# Altium project QUTMS_Shutdownboard_V2_1.PrjPcb
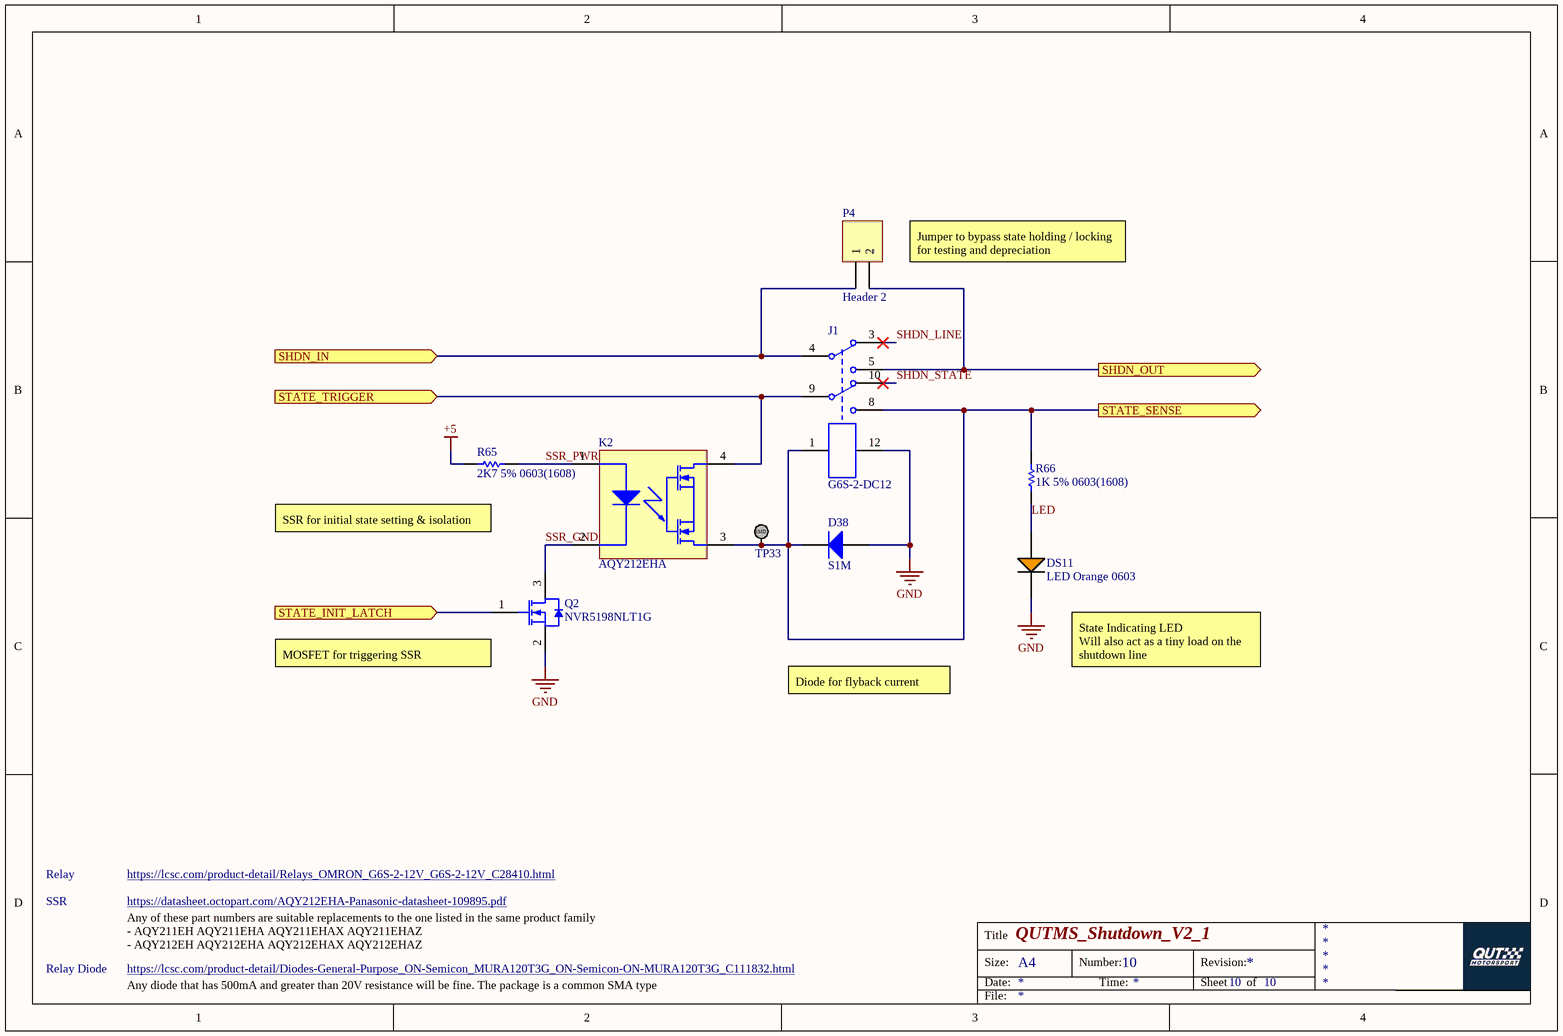
[diagram p0: ShutdownSegement.SchDoc]
4 sheets, 93 parts. Net scope: hierarchical (ports join the sheet entries above them; power ports are global).
Board file: DeutschPCB.PcbDoc
Sheets:
  ShutdownSegement.SchDoc
  Master.SchDoc
    BSPD_Simulation = BSPD_Simulation.SchDoc
    SHDN_INPUT_PROTECTION1 = 12VInputProtection.SchDoc
    SHDN_INPUT_PROTECTION2 = 12VInputProtection.SchDoc
    SHDN_INPUT_PROTECTION3 = 12VInputProtection.SchDoc
    SHDN_INPUT_PROTECTION4 = 12VInputProtection.SchDoc
    SHDN_INPUT_PROTECTION5 = 12VInputProtection.SchDoc
    SHDN_INPUT_PROTECTION6 = 12VInputProtection.SchDoc
    SHDN_INPUT_PROTECTION7 = 12VInputProtection.SchDoc
    SHDN_INPUT_PROTECTION8 = 12VInputProtection.SchDoc
    SHDN_INPUT_PROTECTION9 = 12VInputProtection.SchDoc
    SHDN_INPUT_PROTECTION10 = 12VInputProtection.SchDoc
    SHDN_INPUT_PROTECTION11 = 12VInputProtection.SchDoc
    SHDN_INPUT_PROTECTION12 = 12VInputProtection.SchDoc
    SHDN_INPUT_PROTECTION13 = 12VInputProtection.SchDoc
    SHDN_INPUT_PROTECTION14 = 12VInputProtection.SchDoc
    SHDN_INPUT_PROTECTION15 = 12VInputProtection.SchDoc
    SHDN_INPUT_PROTECTION16 = 12VInputProtection.SchDoc
    SHDN_INPUT_PROTECTION17 = 12VInputProtection.SchDoc
    SHDN_INPUT_PROTECTION18 = 12VInputProtection.SchDoc

## Sheet ShutdownSegement.SchDoc: QUTMS_Shutdown_V2_1
size A4; DocumentNumber: 10; SheetNumber: 10; SheetTotal: 10

### Parts
D38  S1M  [FAIR-DO-214AC-2_V]
DS11  LED Orange 0603  [LED ORANGE 0603]
J1  G6S-2-DC12  [G6S-2]
K2  AQY212EHA  [PNSC-DIP4(SMT)_V]
P4  Header 2  [HDR1X2]
Q2  NVR5198NLT1G  [ONSC-SOT-23-3-318-08_V]
R65  2K7 5% 0603(1608)  [RESC0603(1608)_M]
R66  1K 5% 0603(1608)  [RESC0603(1608)_L]
TP33  TestPoint_SMD  [TestPointSMD]  (value not drawn)

### Ports
SHDN_IN (in), SHDN_OUT (out), STATE_INIT_LATCH (in), STATE_SENSE (out), STATE_TRIGGER (in)

### Nets
+5: R65.1
GND: D38.1(A) DS11.2(C) J1.12 Q2.2(S)
LED: DS11.1(A) R66.1
SHDN_LINE: J1.3
SHDN_STATE: J1.10
SSR_GND: K2.2 Q2.3(D)
SSR_PWR: K2.1 R65.2
NetD38_2: D38.2(K) J1.1 J1.8 K2.3 R66.2 TP33.1 ; port STATE_SENSE
NetJ1_4: J1.4 P4.1 ; port SHDN_IN
NetJ1_5: J1.5 P4.2 ; port SHDN_OUT
NetJ1_9: J1.9 K2.4 ; port STATE_TRIGGER
NetQ2_1: Q2.1(G) ; port STATE_INIT_LATCH

### Notes on the sheet
- (near P4) Jumper to bypass state holding / locking for testing and depreciation
- (near R65) SSR for initial state setting & isolation
- (near Q2) MOSFET for triggering SSR
- Diode for flyback current
- State Indicating LED
  Will also act as a tiny load on the shutdown line
- SSR
- Relay
- https://datasheet.octopart.com/AQY212EHA-Panasonic-datasheet-109895.pdf
- https://lcsc.com/product-detail/Relays_OMRON_G6S-2-12V_G6S-2-12V_C28410.html
- Relay Diode
- Any of these part numbers are suitable replacements to the one listed in the same product family
  - AQY211EH AQY211EHA AQY211EHAX AQY211EHAZ
  - AQY212EH AQY212EHA AQY212EHAX AQY212EHAZ
- https://lcsc.com/product-detail/Diodes-General-Purpose_ON-Semicon_MURA120T3G_ON-Semicon-ON-MURA120T3G_C111832.html
- Any diode that has 500mA and greater than 20V resistance will be fine. The package is a common SMA type
- Title
- Size:
- Date:
- A4
- Number:
- Time:
- Revision:
- Sheet
- of
- File:
- (in symbol TestPoint_SMD) SMD

### Library data of the parts
D38 = CMP-2000-04942-2: General Purpose Rectifier, 1 A, 1000 V, -55 to 150 degC, 2-Pin DO-214AC, RoHS, Tape and Reel; Manufacturer: Fairchild; Repetitive Reverse Voltage Vrrm Max: 1kV; Reel Quantity: 7500; Forward Voltage: 1V; No. of Pins: 2; External Depth: 2.79mm; Current Ifsm: 30A; Diode Configuration: Single; Reverse Recovery Time trr Max: 1.8µs; Diode Type: StandardRecovery; External Width: 5.28mm; SVHC: NoSVHC(19-Dec-2012); External Length / Height: 2.44mm; Diode Polarity: Cathode; Current If @ Vf: 1A; SMD Marking: 1M; Tape Width: 12mm; Datasheet URL: https://datasheet.ciiva.com/4452/s1m-191340-4452980.pdf; Alternate Case Style: DO-214AC; Package Reference: DO-214AC-2; Diode Case Style: DO-214AC; Package / Case: SMA; Junction Temperature Tj Max: 150degC; Operating Temperature Range: -55degCto+150degC; Operating Temperature Min: -55degC; Datasheet Version: Rev. 1.1.2, 10/2013; Manufacturer URL: https://www.fairchildsemi.com/; Termination Type: SMD; Forward Surge Current Ifsm Max: 30A; Operating Temperature Max: 150degC; Package Description: 2-Pin Surface Mount Device, Body 4.375 x 2.725 mm; Package URL: https://www.fairchildsemi.com/package-drawings/DO/DO214AC.pdf; Reverse Recovery Time trr Typ: 1.8µs; Forward Voltage VF Max: 1V; Forward Current If(AV): 1A
J1 = G6S-2-DC12: Telecom Non Latching 12VDC DPDT 2A Through Hole Relays RoHS; ComponentLink1Description: LCSC; ComponentLink1URL: https://lcsc.com/product-detail/Relays_OMRON_G6S-2-12V_G6S-2-12V_C28410.html
K2 = CMP-1346-00006-1: PhotoMOS GE 1 Form A, 60 V Load Voltage, 0.55 A Continuous Load Current, -40 to 85 degC, 4-Pin DIP(SMT), Tube, RoHS; Manufacturer: Panasonic; Continuous Load Current: 0.55 A; Load Voltage: 60 V; On Resistance (Typ): 0.85 Ohm; Pb-Free: True; ComponentLink2Description: Datasheet; PackageVersion: ASCTB67E, 04/2014; DatasheetVersion: 201404-T; Packing: Tube; ComponentLink1URL: http://www3.panasonic.biz/ac/ae/index.jsp; PackageReference: DIP4(SMT); Series: PhotoMOS GE 1 Form A; RoHS: True; ComponentLink1Description: Manufacturer URL; ComponentLink3Description: Package Specification; PartNumber: AQY212EHA; PackageDescription: 4-Pin Surface Mount Terminal Package, Body 4.78 x 6.4 mm, Pitch 2.54mm; ComponentLink2URL: http://www3.panasonic.biz/ac/e_download/control/relay/photomos/catalog/semi_eng_ge1a_aqy21_e.pdf; ComponentLink3URL: http://www3.panasonic.biz/ac/e_download/control/relay/photomos/catalog/semi_eng_dimensions.pdf?f_cd=401560; Mounting Technology: Surface Mount
P4 = Header 2: Header, 2-Pin; LatestRevisionDate: 17-Jul-2002; LatestRevisionNote: Re-released for DXP Platform.; Publisher: Altium Limited
Q2 = CMP-1058-00774-1: Power MOSFET, 60 V, 155 mOhm, Single N-Channel Logic Level, 3-Pin SOT-23, Pb-Free, Tape and Reel; Manufacturer: On Semiconductor; Ciss Typ (pF): 182; Coss Typ (pF): 25; ID Max (A): 2.2; Crss Typ (pF): 16; V(BR)DSS Min (V): 60; Qrr Typ (nC): 6; VGS Max (V): 20; VGS(th) Max (V): 2.5; Channel Polarity: N Channel; Package Type: SOT-23-3; ComponentLink1URL: http://www.onsemi.com/; ComponentLink2Description: Datasheet; ComponentLink1Description: Manufacturer URL; Mounting Technology: Surface Mount; Configuration: Single; Packing: Tape and Reel; RoHS: Pb-Free; ComponentLink3URL: http://www.onsemi.cn/pub_link/Collateral/318-08.PDF; PackageVersion: Rev. AP, 11/2009; PackageReference: SOT-23-3-318-08; DatasheetVersion: Rev. 1; PackageDescription: 3-Pin Small Outline Transistor, Body 2.92 x 1.3 mm, Pitch 0.95 mm; ComponentLink3Description: Package Specification; ComponentLink2URL: http://www.onsemi.com/pub_link/Collateral/NVR5198NL-D.PDF; PartNumber: NVR5198NLT1G
R65 = CMP-1012-00084-1: 2K7 0.1W 5% 0603 (1608 Metric)  SMD; Case-EIA: 0603; Value: 2700.00 Ohm; Case-Metric: 1608; Tolerance: 5 %; Power: 0.1 W; Technology: SMT
R66 = CMP-1012-00074-1: 1K 0.1W 5% 0603 (1608 Metric)  SMD; Case-EIA: 0603; Case-Metric: 1608; Value: 1000.00 Ohm; Technology: SMT; Tolerance: 5 %; Power: 0.1 W

## Sheet Master.SchDoc
size A3
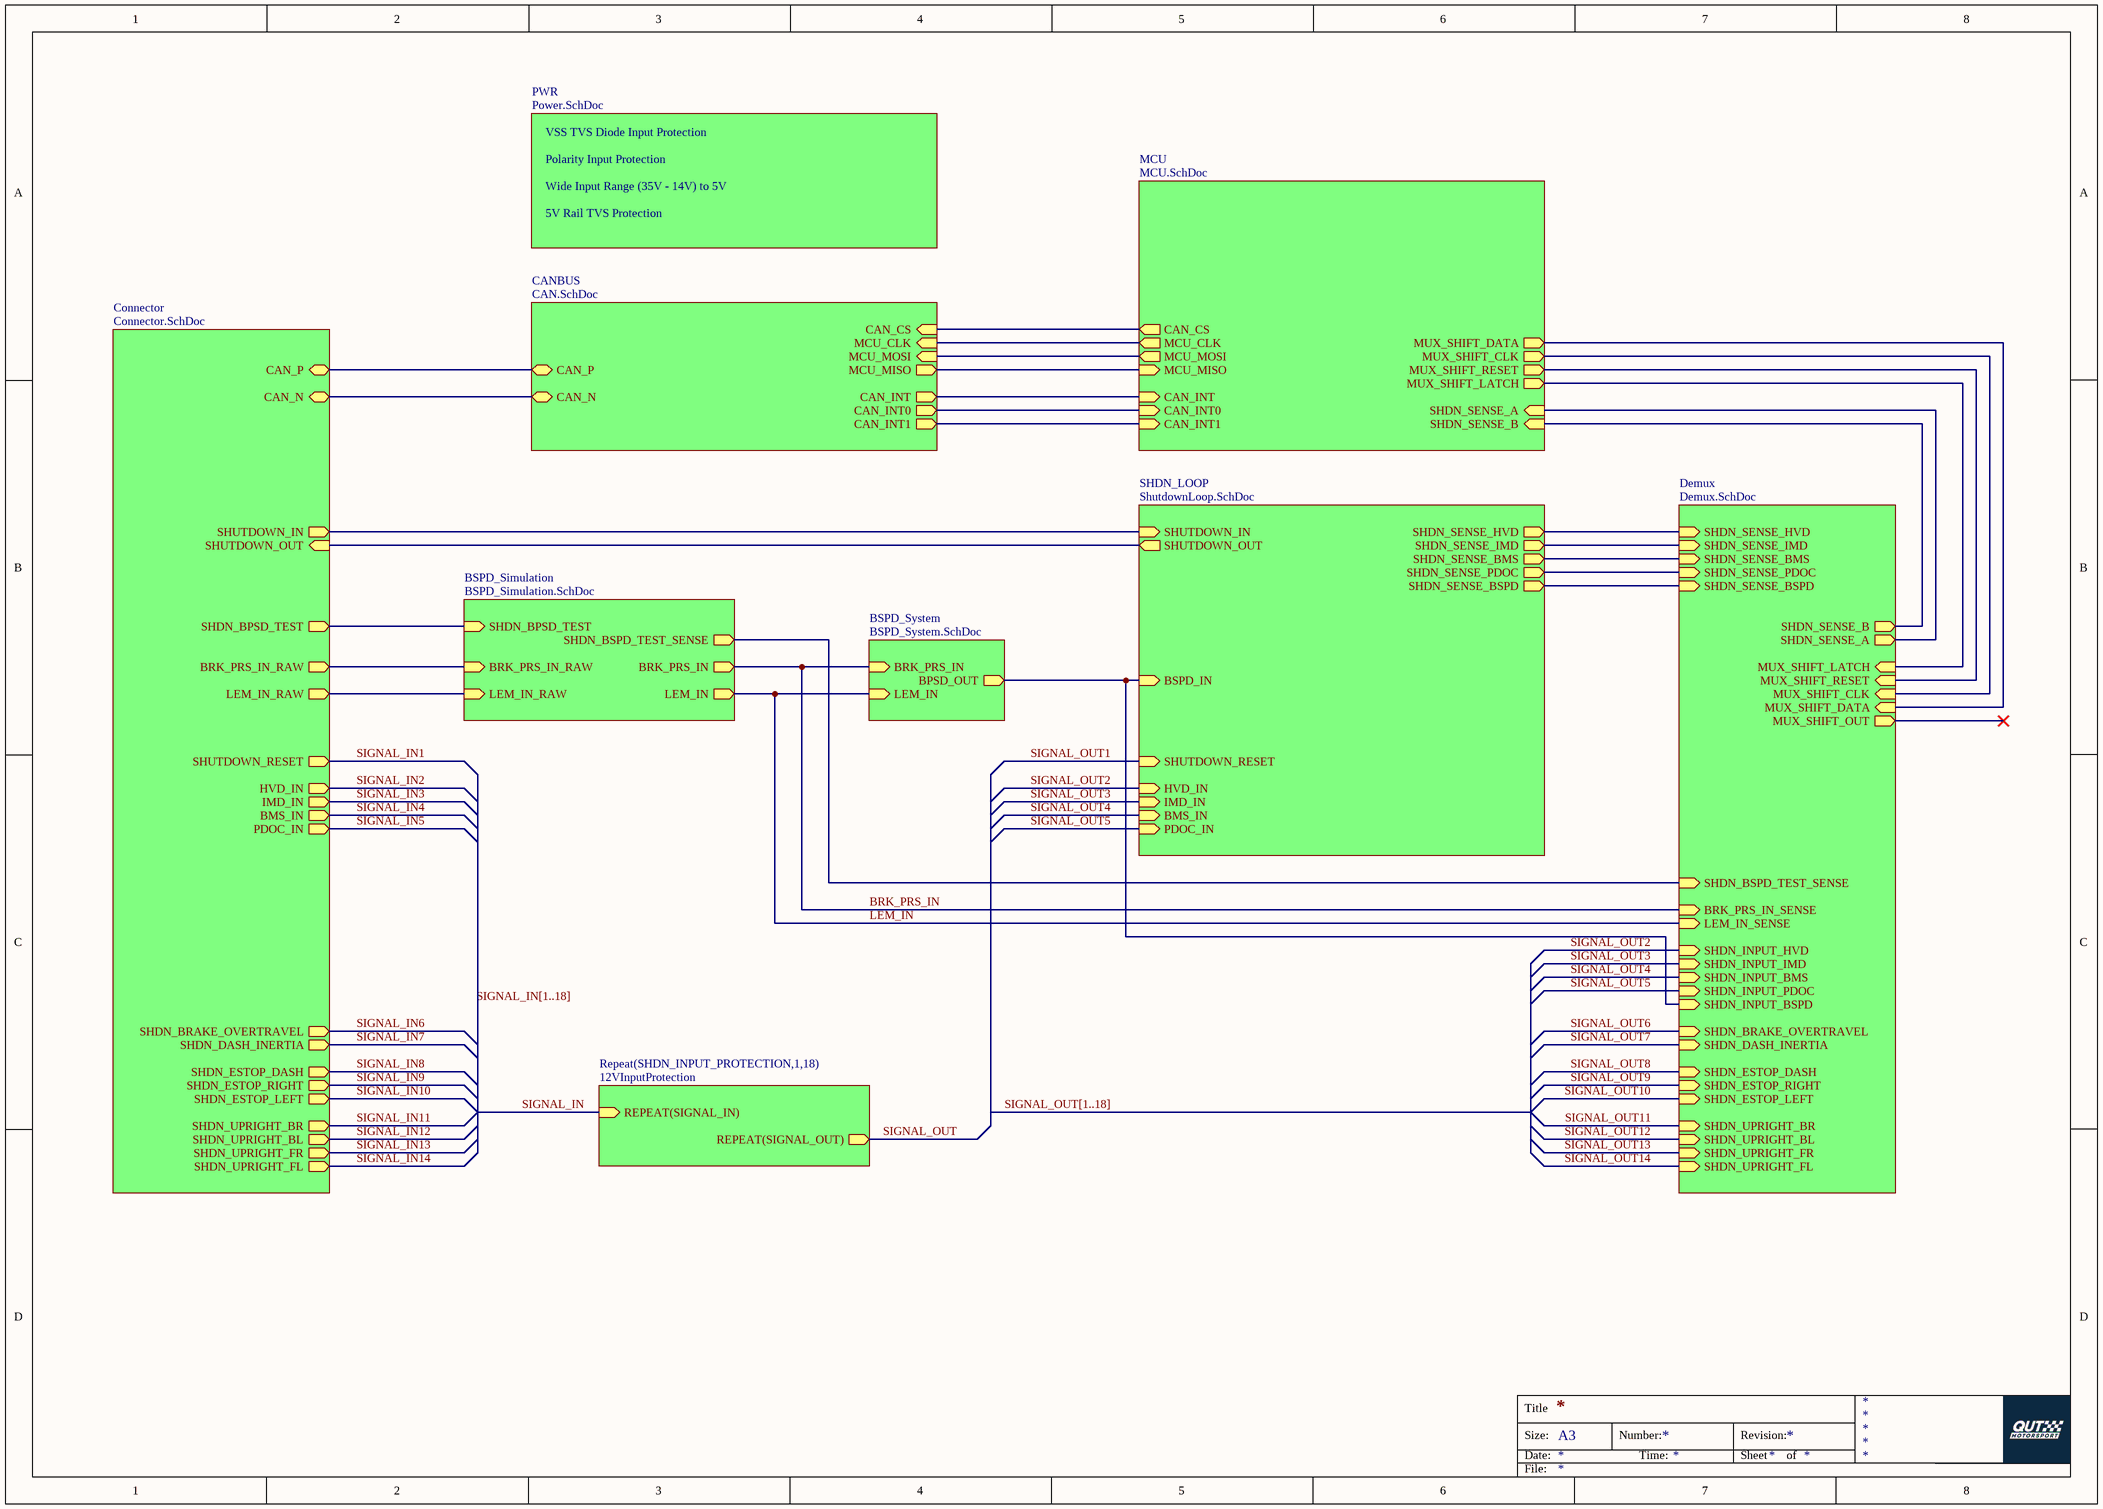
[diagram p1: Master.SchDoc]

### Sub-sheets
BSPD_Simulation = BSPD_Simulation.SchDoc: LEM_IN_RAW (in), SHDN_BSPD_TEST_SENSE (out), BRK_PRS_IN (out), LEM_IN (out), SHDN_BPSD_TEST (in), BRK_PRS_IN_RAW (in)
BSPD_System = BSPD_System.SchDoc (file not in this document): BRK_PRS_IN (in), BPSD_OUT (out), LEM_IN (in)
CANBUS = CAN.SchDoc (file not in this document): MCU_MOSI (in), MCU_CLK (in), CAN_CS (in), MCU_MISO (out), CAN_N (bidir), CAN_P (bidir), CAN_INT1 (out), CAN_INT0 (out), CAN_INT (out)
Connector = Connector.SchDoc (file not in this document): SHDN_BRAKE_OVERTRAVEL (out), SHDN_BPSD_TEST (out), CAN_N (bidir), CAN_P (bidir), SHUTDOWN_IN (out), HVD_IN (out), SHUTDOWN_OUT (in), BRK_PRS_IN_RAW (out), LEM_IN_RAW (out), IMD_IN (out), BMS_IN (out), SHDN_ESTOP_DASH (out), SHDN_DASH_INERTIA (out), PDOC_IN (out), SHUTDOWN_RESET (out), SHDN_ESTOP_RIGHT (out), SHDN_ESTOP_LEFT (out), SHDN_UPRIGHT_BR (out), SHDN_UPRIGHT_BL (out), SHDN_UPRIGHT_FR (out), SHDN_UPRIGHT_FL (out)
Demux = Demux.SchDoc (file not in this document): SHDN_ESTOP_DASH (in), SHDN_UPRIGHT_BL (in), SHDN_UPRIGHT_BR (in), SHDN_ESTOP_LEFT (in), SHDN_ESTOP_RIGHT (in), SHDN_DASH_INERTIA (in), SHDN_UPRIGHT_FR (in), SHDN_UPRIGHT_FL (in), SHDN_BRAKE_OVERTRAVEL (in), SHDN_BSPD_TEST_SENSE (in), BRK_PRS_IN_SENSE (in), LEM_IN_SENSE (in), SHDN_INPUT_HVD (in), SHDN_INPUT_IMD (in), SHDN_INPUT_BMS (in), SHDN_INPUT_PDOC (in), SHDN_INPUT_BSPD (in), SHDN_SENSE_HVD (in), SHDN_SENSE_IMD (in), SHDN_SENSE_BMS (in), SHDN_SENSE_PDOC (in), SHDN_SENSE_BSPD (in), SHDN_SENSE_A (out), MUX_SHIFT_OUT (out), SHDN_SENSE_B (out), MUX_SHIFT_LATCH (in), MUX_SHIFT_RESET (in), MUX_SHIFT_CLK (in), MUX_SHIFT_DATA (in)
MCU = MCU.SchDoc (file not in this document): MCU_MISO (in), MCU_MOSI (out), CAN_CS (out), MCU_CLK (out), CAN_INT (in), CAN_INT0 (in), CAN_INT1 (in), SHDN_SENSE_B (in), SHDN_SENSE_A (in), MUX_SHIFT_LATCH (out), MUX_SHIFT_RESET (out), MUX_SHIFT_CLK (out), MUX_SHIFT_DATA (out)
PWR = Power.SchDoc (file not in this document): no entries
Repeat(SHDN_INPUT_PROTECTION,1,18) = 12VInputProtection: REPEAT(SIGNAL_OUT) (out), REPEAT(SIGNAL_IN) (in)
SHDN_LOOP = ShutdownLoop.SchDoc (file not in this document): SHDN_SENSE_BSPD (out), SHDN_SENSE_PDOC (out), SHDN_SENSE_BMS (out), SHDN_SENSE_IMD (out), HVD_IN (in), SHUTDOWN_RESET (in), IMD_IN (in), BMS_IN (in), PDOC_IN (in), SHUTDOWN_OUT (out), SHUTDOWN_IN (in), BSPD_IN (in), SHDN_SENSE_HVD (out)

### Nets
BRK_PRS_IN: sheet Demux/BRK_PRS_IN_SENSE, sheet BSPD_System/BRK_PRS_IN, sheet BSPD_Simulation/BRK_PRS_IN
LEM_IN: sheet Demux/LEM_IN_SENSE, sheet BSPD_System/LEM_IN, sheet BSPD_Simulation/LEM_IN
SHDN_BSPD_TEST_COMMAND: sheet Demux/SHDN_BSPD_TEST_SENSE, sheet BSPD_Simulation/SHDN_BSPD_TEST_SENSE
SIGNAL_IN: sheet Repeat(SHDN_INPUT_PROTECTION,1,18)/REPEAT(SIGNAL_IN)
SIGNAL_IN1: sheet Connector/SHUTDOWN_RESET, sheet SHDN_LOOP/SHUTDOWN_RESET  [also labelled SIGNAL_OUT1]
SIGNAL_IN2: sheet Connector/HVD_IN, sheet SHDN_LOOP/HVD_IN, sheet Demux/SHDN_INPUT_HVD  [also labelled SIGNAL_OUT2]
SIGNAL_IN3: sheet Connector/IMD_IN, sheet SHDN_LOOP/IMD_IN, sheet Demux/SHDN_INPUT_IMD  [also labelled SIGNAL_OUT3]
SIGNAL_IN4: sheet Connector/BMS_IN, sheet SHDN_LOOP/BMS_IN, sheet Demux/SHDN_INPUT_BMS  [also labelled SIGNAL_OUT4]
SIGNAL_IN5: sheet Connector/PDOC_IN, sheet SHDN_LOOP/PDOC_IN, sheet Demux/SHDN_INPUT_PDOC  [also labelled SIGNAL_OUT5]
SIGNAL_IN6: sheet Connector/SHDN_BRAKE_OVERTRAVEL, sheet Demux/SHDN_BRAKE_OVERTRAVEL  [also labelled SIGNAL_OUT6]
SIGNAL_IN7: sheet Connector/SHDN_DASH_INERTIA, sheet Demux/SHDN_DASH_INERTIA  [also labelled SIGNAL_OUT7]
SIGNAL_IN8: sheet Connector/SHDN_ESTOP_DASH, sheet Demux/SHDN_ESTOP_DASH  [also labelled SIGNAL_OUT8]
SIGNAL_IN9: sheet Connector/SHDN_ESTOP_RIGHT, sheet Demux/SHDN_ESTOP_RIGHT  [also labelled SIGNAL_OUT9]
SIGNAL_IN10: sheet Connector/SHDN_ESTOP_LEFT, sheet Demux/SHDN_ESTOP_LEFT  [also labelled SIGNAL_OUT10]
SIGNAL_IN11: sheet Connector/SHDN_UPRIGHT_BR, sheet Demux/SHDN_UPRIGHT_BR  [also labelled SIGNAL_OUT11]
SIGNAL_IN12: sheet Connector/SHDN_UPRIGHT_BL, sheet Demux/SHDN_UPRIGHT_BL  [also labelled SIGNAL_OUT12]
SIGNAL_IN13: sheet Connector/SHDN_UPRIGHT_FR, sheet Demux/SHDN_UPRIGHT_FR  [also labelled SIGNAL_OUT13]
SIGNAL_IN14: sheet Connector/SHDN_UPRIGHT_FL, sheet Demux/SHDN_UPRIGHT_FL  [also labelled SIGNAL_OUT14]
SIGNAL_OUT: sheet Repeat(SHDN_INPUT_PROTECTION,1,18)/REPEAT(SIGNAL_OUT)
NetC1_1: sheet Connector/BRK_PRS_IN_RAW, sheet BSPD_Simulation/BRK_PRS_IN_RAW
NetC4_1: sheet Connector/LEM_IN_RAW, sheet BSPD_Simulation/LEM_IN_RAW
NetR4_2: sheet Connector/SHDN_BPSD_TEST, sheet BSPD_Simulation/SHDN_BPSD_TEST
(unnamed): sheet Connector/CAN_N, sheet CANBUS/CAN_N
(unnamed): sheet Connector/CAN_P, sheet CANBUS/CAN_P
(unnamed): sheet Connector/SHUTDOWN_IN, sheet SHDN_LOOP/SHUTDOWN_IN
(unnamed): sheet Connector/SHUTDOWN_OUT, sheet SHDN_LOOP/SHUTDOWN_OUT
(unnamed): sheet SHDN_LOOP/SHDN_SENSE_BSPD, sheet Demux/SHDN_SENSE_BSPD
(unnamed): sheet SHDN_LOOP/SHDN_SENSE_PDOC, sheet Demux/SHDN_SENSE_PDOC
(unnamed): sheet SHDN_LOOP/SHDN_SENSE_BMS, sheet Demux/SHDN_SENSE_BMS
(unnamed): sheet SHDN_LOOP/SHDN_SENSE_IMD, sheet Demux/SHDN_SENSE_IMD
(unnamed): sheet SHDN_LOOP/BSPD_IN, sheet Demux/SHDN_INPUT_BSPD, sheet BSPD_System/BPSD_OUT
(unnamed): sheet SHDN_LOOP/SHDN_SENSE_HVD, sheet Demux/SHDN_SENSE_HVD
(unnamed): sheet MCU/MCU_MISO, sheet CANBUS/MCU_MISO
(unnamed): sheet MCU/MCU_MOSI, sheet CANBUS/MCU_MOSI
(unnamed): sheet MCU/CAN_CS, sheet CANBUS/CAN_CS
(unnamed): sheet MCU/MCU_CLK, sheet CANBUS/MCU_CLK
(unnamed): sheet MCU/CAN_INT, sheet CANBUS/CAN_INT
(unnamed): sheet MCU/CAN_INT0, sheet CANBUS/CAN_INT0
(unnamed): sheet MCU/CAN_INT1, sheet CANBUS/CAN_INT1
(unnamed): sheet MCU/SHDN_SENSE_B, sheet Demux/SHDN_SENSE_B
(unnamed): sheet MCU/SHDN_SENSE_A, sheet Demux/SHDN_SENSE_A
(unnamed): sheet MCU/MUX_SHIFT_LATCH, sheet Demux/MUX_SHIFT_LATCH
(unnamed): sheet MCU/MUX_SHIFT_RESET, sheet Demux/MUX_SHIFT_RESET
(unnamed): sheet MCU/MUX_SHIFT_CLK, sheet Demux/MUX_SHIFT_CLK
(unnamed): sheet MCU/MUX_SHIFT_DATA, sheet Demux/MUX_SHIFT_DATA

### Buses and harness runs
bus SIGNAL_IN[1..18]
bus SIGNAL_OUT[1..18]

### Notes on the sheet
- VSS TVS Diode Input Protection
- Polarity Input Protection
- Wide Input Range (35V - 14V) to 5V
- 5V Rail TVS Protection
- Labels drawn without touching a wire or pin: SIGNAL_IN[1..18]
- Title
- Size:
- Date:
- A3
- Number:
- Time:
- Revision:
- Sheet
- of
- File:

## Sheet BSPD_Simulation.SchDoc: QUTMS Shutdown V2 - BSPD_Simulation
size A3; Author: Jonn Dillon; Organization: QUT Motorsport; Address1: O-120; Address2: O Block; Address3: QUT Gardens Point; Address4: Brisbane, 4000; DocumentNumber: 6; SheetNumber: 6; SheetTotal: 10
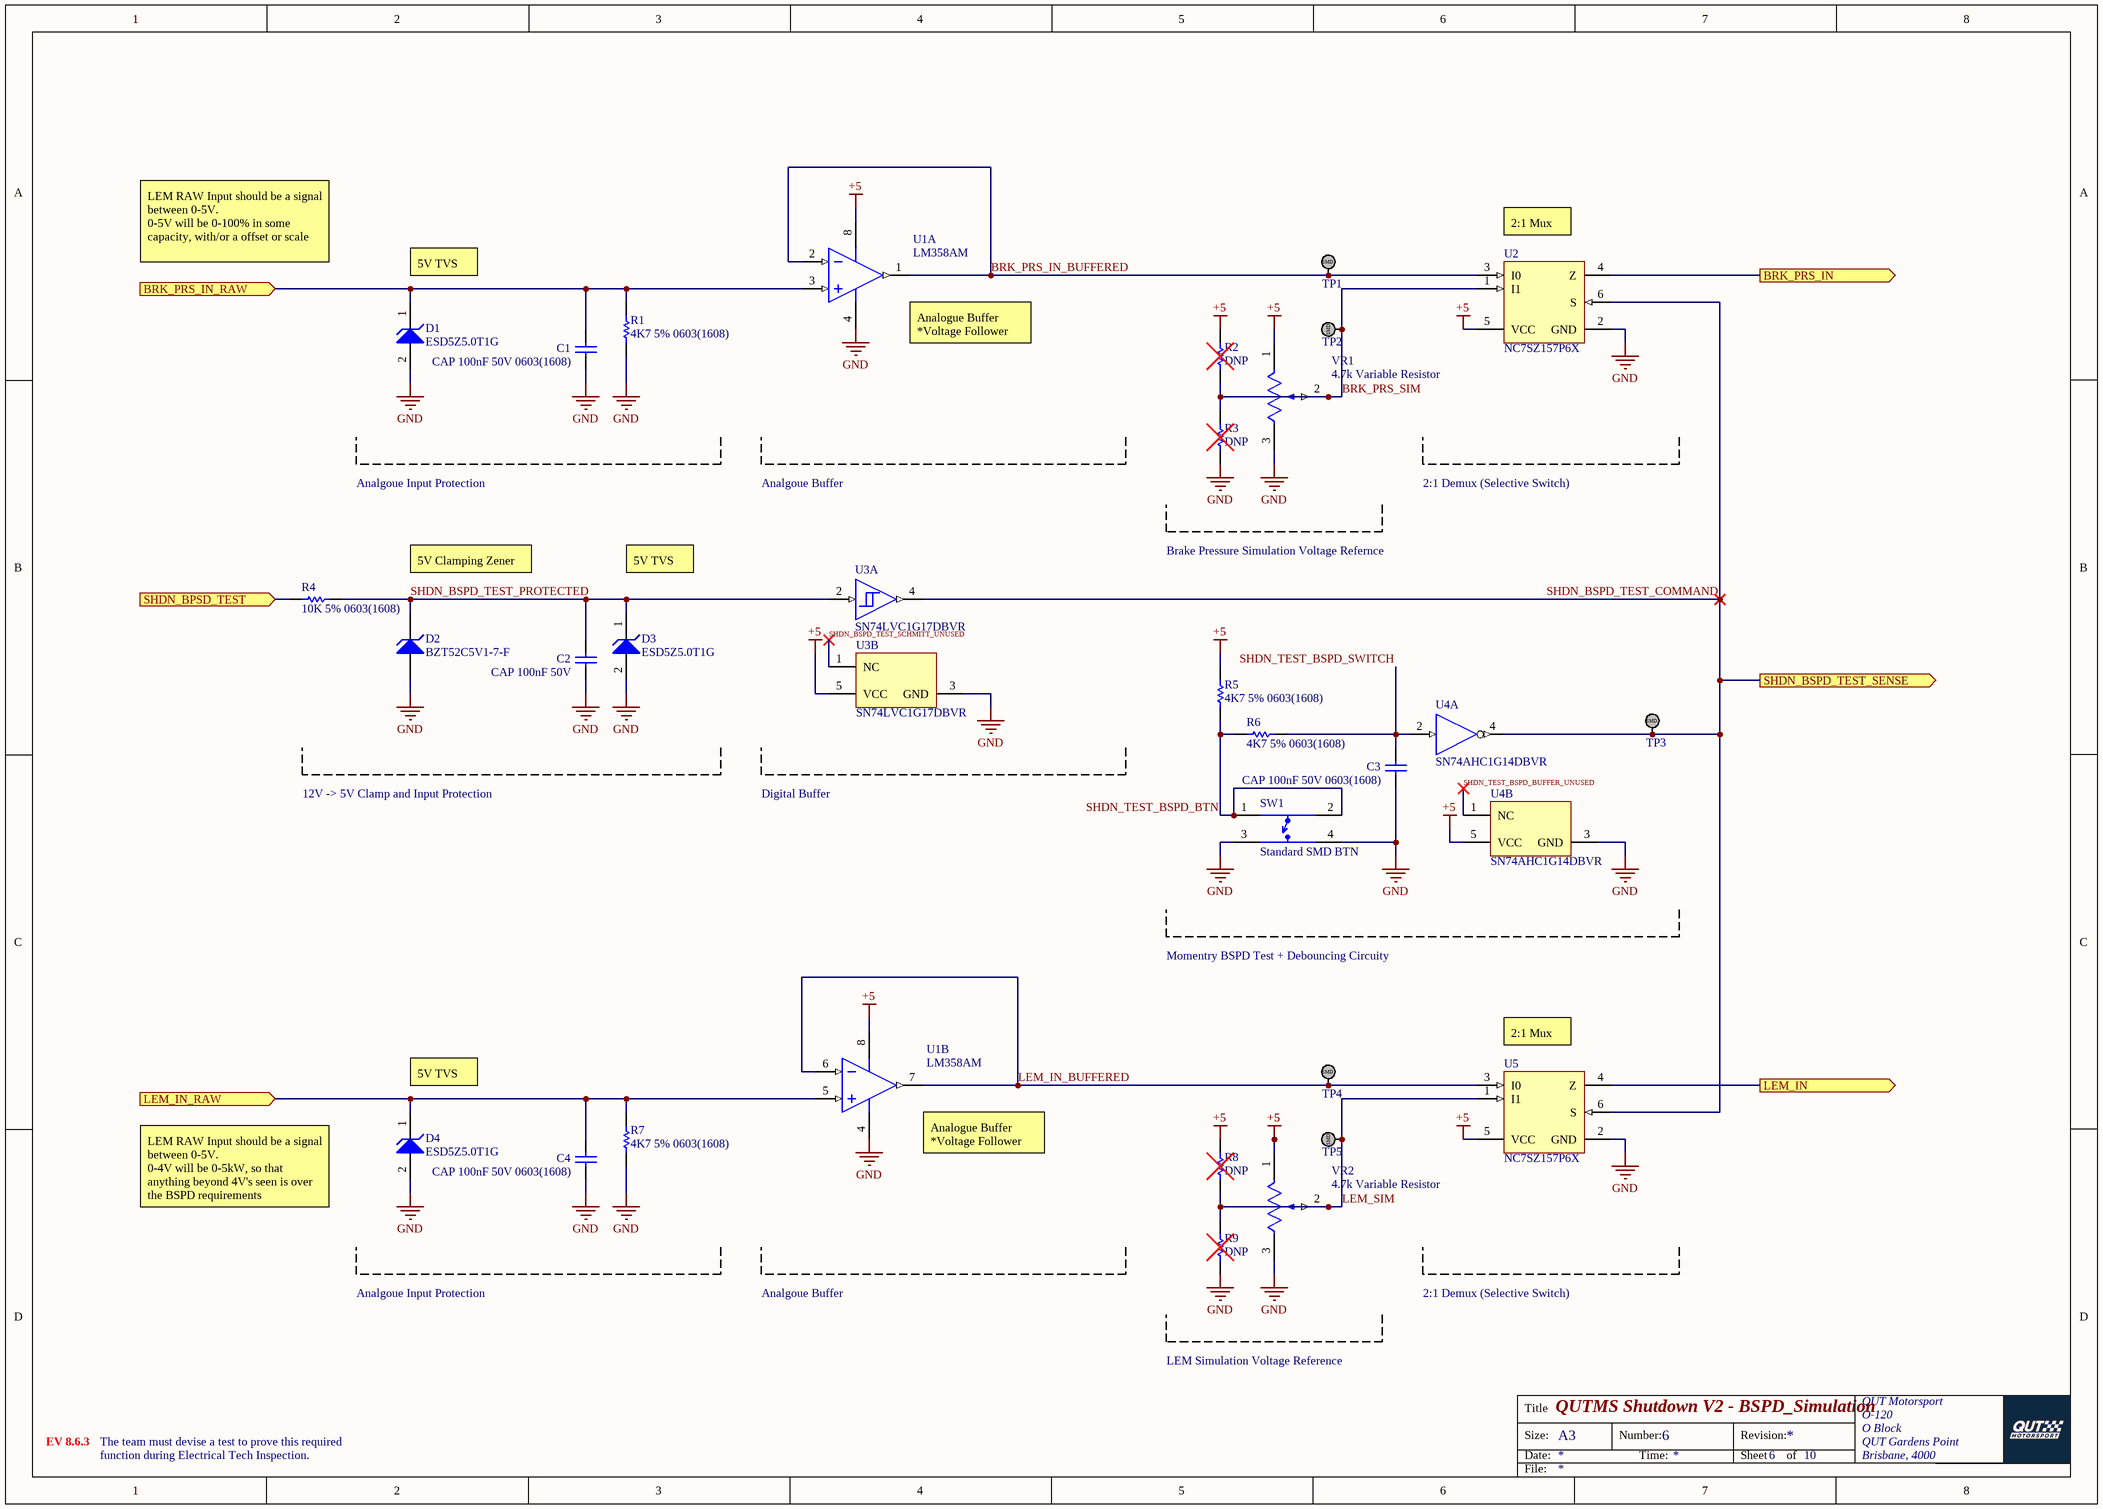
[diagram p2: BSPD_Simulation.SchDoc]

### Parts
C1  CAP 100nF 50V 0603(1608)  [CAPC0603(1608)100_L]
C2  CAP 100nF 50V  [CAPC0603(1608)100_L]
C3  CAP 100nF 50V 0603(1608)  [CAPC0603(1608)100_L]
C4  CAP 100nF 50V 0603(1608)  [CAPC0603(1608)100_L]
D1  ESD5Z5.0T1G  [ONSC-SOD-523-2-502-01_V]
D2  BZT52C5V1-7-F  [DIOD-SOD123_V]
D3  ESD5Z5.0T1G  [ONSC-SOD-523-2-502-01_V]
D4  ESD5Z5.0T1G  [ONSC-SOD-523-2-502-01_V]
R1  4K7 5% 0603(1608)  [RESC0603(1608)_N]
R2  DNP  [RESC0603(1608)_L]
R3  DNP  [RESC0603(1608)_L]
R4  10K 5% 0603(1608)  [RESC0603(1608)_N]
R5  4K7 5% 0603(1608)  [RESC0603(1608)_N]
R6  4K7 5% 0603(1608)  [RESC0603(1608)_N]
R7  4K7 5% 0603(1608)  [RESC0603(1608)_N]
R8  DNP  [RESC0603(1608)_L]
R9  DNP  [RESC0603(1608)_L]
SW1  Standard SMD BTN  [StandardSMDBTN]
TP1  TestPoint_SMD  [TestPointSMD]  (value not drawn)
TP2  TestPoint_SMD  [TestPointSMD]  (value not drawn)
TP3  TestPoint_SMD  [TestPointSMD]  (value not drawn)
TP4  TestPoint_SMD  [TestPointSMD]  (value not drawn)
TP5  TestPoint_SMD  [TestPointSMD]  (value not drawn)
U1  LM358AM  [D0008A_N]  (parts A,B of 2)
U2  NC7SZ157P6X  [FAIR-SC70-6_V]
U3  SN74LVC1G17DBVR  [DBV0005A_L]  (parts A,B of 2)
U4  SN74AHC1G14DBVR  [DBV0005A_L]  (parts A,B of 2)
U5  NC7SZ157P6X  [FAIR-SC70-6_V]
VR1  4.7k Variable Resistor  [VG039NCHXTB472]
VR2  4.7k Variable Resistor  [VG039NCHXTB472]

### Ports
BRK_PRS_IN (out), BRK_PRS_IN_RAW (in), LEM_IN (out), LEM_IN_RAW (in), SHDN_BPSD_TEST (in), SHDN_BSPD_TEST_SENSE (out)

### Nets
+5: R2.2 R5.2 R8.2 U1.8(V+) U2.5(VCC) U3.5(VCC) U4.5(VCC) U5.5(VCC) VR1.1 VR2.1
GND: C1.2 C2.2 C3.2 C4.2 D1.2(A) D2.1(A) D3.2(A) D4.2(A) R1.1 R3.1 R7.1 R9.1 SW1.3 SW1.4 U1.4(GND) U2.2(GND) U3.3(GND) U4.3(GND) U5.2(GND) VR1.3 VR2.3
BRK_PRS_IN: U2.4(Z) ; port BRK_PRS_IN
BRK_PRS_IN_BUFFERED: TP1.1 U1.1(OUTA) U1.2(INA-) U2.3(I0)
BRK_PRS_SIM: R2.1 R3.2 TP2.1 U2.1(I1) VR1.2
LEM_IN: U5.4(Z) ; port LEM_IN
LEM_IN_BUFFERED: TP4.1 U1.6(INB-) U1.7(OUTB) U5.3(I0)
LEM_SIM: R8.1 R9.2 TP5.1 U5.1(I1) VR2.2
SHDN_BSPD_TEST_COMMAND: TP3.1 U2.6(S) U3.4(Y) U4.4(Y) U5.6(S) ; port SHDN_BSPD_TEST_SENSE
SHDN_BSPD_TEST_PROTECTED: C2.1 D2.2(K) D3.1(K) R4.1 U3.2(A)
SHDN_BSPD_TEST_SCHMITT_UNUSED: U3.1(NC)
SHDN_TEST_BSPD_BTN: R5.1 R6.2 SW1.1 SW1.2
SHDN_TEST_BSPD_BUFFER_UNUSED: U4.1(NC)
SHDN_TEST_BSPD_SWITCH: C3.1 R6.1 U4.2(A)
NetC1_1: C1.1 D1.1(K) R1.2 U1.3(INA+) ; port BRK_PRS_IN_RAW
NetC4_1: C4.1 D4.1(K) R7.2 U1.5(INB+) ; port LEM_IN_RAW
NetR4_2: R4.2 ; port SHDN_BPSD_TEST

### Notes on the sheet
- (near U2) 2:1 Mux
- LEM RAW Input should be a signal between 0-5V.
  0-5V will be 0-100% in some capacity, with/or a offset or scale
- 5V TVS
- (near U1) Analogue Buffer
  *Voltage Follower
- Analgoue Input Protection
- Analgoue Buffer
- 2:1 Demux (Selective Switch)
- 5V Clamping Zener
- Brake Pressure Simulation Voltage Refernce
- 12V -> 5V Clamp and Input Protection
- Digital Buffer
- Momentry BSPD Test + Debouncing Circuity
- (near U5) 2:1 Mux
- LEM RAW Input should be a signal between 0-5V.
  0-4V will be 0-5kW, so that anything beyond 4V's seen is over the BSPD requirements
  5V =
- LEM Simulation Voltage Reference
- EV 8.6.3
- The team must devise a test to prove this required
- function during Electrical Tech Inspection.
- Title
- Size:
- Date:
- A3
- Number:
- Time:
- Revision:
- Sheet
- of
- File:
- (in symbol TestPoint_SMD) SMD

### Library data of the parts
C1-C4 = CMP-1035-02591-1: CAP 100nF 50V ±5% 0603 (1608 Metric) Thickness 1mm SMD; Tolerance: Â±5%; Case-Metric: 1608; Case-EIA: 0603; Rated Voltage: 50 V; Max Thickness: 1 mm; Technology: SMT; Value: 100nF
D1 D3 D4 = CMP-1063-00102-1: Transient Voltage Suppressor, Micro-Packaged Diode for ESD Protection, 2-Pin SOD-523, Pb-Free, Tape and Reel; Manufacturer: On Semiconductor; V(BR) Min (V): 6.2; VRWM Max (V): 5; Number of Lines: 1; PPK Max (W): 174; IR Max (uA): 0.05; Direction: Unidirectional; PackageVersion: Rev. E, 09/2010; Mounting Technology: Surface Mount; Packing: Tape and Reel; ComponentLink2URL: http://www.onsemi.cn/pub_link/Collateral/ESD5Z2.5T1-D.PDF; ComponentLink2Description: Datasheet; PackageReference: SOD-523-2-502-01; ComponentLink1Description: Manufacturer URL; ComponentLink3URL: http://www.onsemi.com/pub_link/Collateral/502-01.PDF; PackageDescription: 2-Pin SOD, Body 1.2 x 0.8 mm; ComponentLink3Description: Package Specification; ComponentLink1URL: http://www.onsemi.com/; RoHS: Pb-Free; PartNumber: ESD5Z5.0T1G; DatasheetVersion: Rev. 10
D2 = CMP-2000-05976-1: Surface Mount Zener Diode, 5.1 V, -65 to 150 degC, 2-Pin SMD (SOD-123), RoHS, Tape and Reel; Manufacturer: DiodesIncorporated; Unit Weight: 0.000353oz; Zz - Zener Impedance: 60Ohms; Vz - Zener Voltage: 5.1V; Pd - Power Dissipation: 500mW; Zener Current: 5mA; Ir - Reverse Current: 2uA; Voltage Temperature Coefficient: -0.75mV/C; Configuration: Single; Voltage Tolerance: 6%; Height: 1.35mm; Width: 1.7mm; Minimum Operating Temperature: -65C; Series: BZT52C5; Package Description: 2-Pin Surface Mount Device, Body 2.7 x 1.55 mm; Length: 2.85mm; Mounting Technology: SurfaceMount; Brand: DiodesIncorporated; Factory Pack Quantity: 3000; Product Category: ZenerDiodes; RoHS: True; Manufacturer URL: http://www.diodes.com/; Termination Style: SMD/SMT; Package / Case: SOD-123; Packaging: Reel; Package Reference: SOD123; Datasheet Version: Rev. 37-2, 09/2012; Maximum Operating Temperature: +150C; Datasheet URL: http://www.diodes.com/_files/datasheets/ds18004.pdf; Mounting Style: SMD/SMT
R1 R5-R7 = CMP-1012-00090-1: 4K7 0.1W 5% 0603 (1608 Metric)  SMD; Case-Metric: 1608; Value: 4700.00 Ohm; Case-EIA: 0603; Tolerance: 5 %; Technology: SMT; Power: 0.1 W
R2 R3 R8 R9 = CMP-1591-00001-1: 0603 (1608 Metric) Chip Resistor; Case-Metric: 1608; Case-EIA: 0603; PackageReference: RESC0603(1608)
R4 = CMP-1012-00098-1: 10K 0.1W 5% 0603 (1608 Metric)  SMD; Case-EIA: 0603; Value: 10000.00 Ohm; Case-Metric: 1608; Technology: SMT; Tolerance: 5 %; Power: 0.1 W
SW1 = Standard SMD BTN: Cost common SMD button, 4 Lead; ComponentLink1Description: LCSC; ComponentLink1URL: https://lcsc.com/product-detail/Tactile-Switches_BRIGHT-TSA063G50-250_C294565.html
U1 = CMP-0055-00796-3: Low Power Dual Operational Amplifier, 8-pin Narrow SOIC; Manufacturer: Texas Instruments; CompType: Amplifiers; PackageTopMarking: NSZXTT*LM*358AM; PowerWise: N; Code_JEDEC: MS-012-AA; RoHS: N; PinCount: 8; Package Reference: D0008A; ComponentLink1Description: Datasheet URL; ComponentLink1URL: http://www.ti.com/general/docs/lit/getliterature.tsp?genericPartNumber=LM358-N&fileType=pdf; Code_IPC: SOIC127P600-8; PackageDescription: SOIC Narrow, 4.9 x 3.9 x 1.45mm, 8 Lead, 1.27mm Pitch
U2 U5 = CMP-2000-06819-1: Tinylogic(R) UHS 2-Input Non-Inverting Multiplexer, 1.65 to 5.5 V, -40 to 85 degC, 6-Pin SOT23 (SC70), RoHS, Tape and Reel; Manufacturer: FairchildSemiconductor; Maximum Low Level Output Current: 32mA; Configuration: 1x2:1; Logic Family: TinyLogicUHS; Maximum Operating Supply Voltage: 5.5V; Number of Inputs per Chip: 2; Maximum Propagation Delay Time @ Maximum CL: 4.6@3.3V; Maximum High Level Output Current: -32mA; Rad Hard: No; Minimum Operating Supply Voltage: 1.65V; Tolerant I/Os: 5.5InputsV; Package: 6SC-70; Package Description: 6-Pin Small Outline Transistor, Body 2 x 1.25 mm, Pitch 0.65 mm; Datasheet Version: 09/2009; Mounting Technology: SurfaceMount; Package URL: https://www.fairchildsemi.com/package-drawings/MA/MAA06A.pdf; Package Reference: SC70-6; Category: Multiplexer; Manufacturer URL: https://www.fairchildsemi.com/; Logic Function: Multiplexer; Packaging: Tape&Reel; Datasheet URL: https://www.fairchildsemi.com/datasheets/NC/NC7SZ157.pdf
U3 = CMP-0859-00033-4: Single Schmitt-Trigger Buffer, DBV0005A, LARGE T&R; Manufacturer: Texas Instruments; Output Drive (IOL/IOH)(Max)(mA): 32/-32; Technology Family: LVC; ICC @ Nom Voltage(Max)(mA): 0.01; VCC(Min)(V): 1.65; F @ Nom Voltage(Max)(Mhz): 150; Schmitt Trigger: Yes; Voltage(Nom)(V): 1.8,2.5,3.3,5; 3-State Output: No; Bits(#): 1; VCC(Max)(V): 5.5; Input Type: CMOS/TTL; Logic: True; tpd @ Nom Voltage(Max)(ns): 11,6.5,5.5,5; Output Type: CMOS; Rating: Catalog; Sub-Family: Non-Inverting Buffer/Driver; PackageReference: DBV0005A; DatasheetVersion: SCES351V; Generic Part Number: SN74LVC1G17; Operating Temperature Range(C): -40 to 125,-40 to 85
U4 = CMP-2000-07131-1: Single Schmitt-Trigger Inverter Gate, 10.6 ns max, 2 to 5.5 V, -40 to 125 degC, 5-Pin SOT23 (DBV), Green (RoHS & no Sb/Br), Tape and Reel; Manufacturer: Texas Instruments; Supply Voltage Min: 2V; Logic IC Function: SingleInverterwithSchmittTrigger; No. of Pins: 5; Logic IC Family: AHC; Output Current: 8mA; Supply Voltage: 5.5V; Logic Function Number: 741G14; SVHC: NoSVHC(19-Dec-2012); No. of Gates: 1; Base Number: 74; Supply Voltage Range: 2Vto5.5V; Logic IC Base Number: 74114; Logic Case Style: SOT-23; Datasheet Version: Rev. Q, 09/2015; Mounting Technology: SurfaceMount; Termination Type: SMD; Operating Temperature Max: 85°C; IC Generic Number: 74AHC1G14; Operating Temperature Min: -40°C; No. of Inputs: 1; Supply Voltage Max: 5.5V; Datasheet URL: http://www.ti.com/lit/ds/symlink/sn74ahc1g14.pdf; Package Description: 5-Pin Small Outline Transistor, Body 2.9 x 1.6 mm, Pitch 0.95 mm; Operating Temperature Range: -40°Cto+85°C; Output Current Max: 8mA; Package URL: http://www.ti.com/lit/ml/mpds018l/mpds018l.pdf; Package Reference: DBV0005A; Logic Type: Inverter; Manufacturer URL: http://www.ti.com/; Package / Case: SOT-23
VR1 VR2 = 4.7k Variable Resistor: 4k7 ±25% ±250 ppm/°C SMD Variable Resistors RoHS | VG039NCHXTB472; ComponentLink1Description: LCSC; ComponentLink1URL: https://lcsc.com/product-detail/Variable-Resistors_HDK-Hokuriku-Elec-Industry-VG039NCHXTB472_C128555.html

## Sheet 12VInputProtection.SchDoc
size A4
Used 18 times, as channels SHDN_INPUT_PROTECTION1, SHDN_INPUT_PROTECTION2, SHDN_INPUT_PROTECTION3, SHDN_INPUT_PROTECTION4, SHDN_INPUT_PROTECTION5, SHDN_INPUT_PROTECTION6, SHDN_INPUT_PROTECTION7, SHDN_INPUT_PROTECTION8, SHDN_INPUT_PROTECTION9, SHDN_INPUT_PROTECTION10, SHDN_INPUT_PROTECTION11, SHDN_INPUT_PROTECTION12, SHDN_INPUT_PROTECTION13, SHDN_INPUT_PROTECTION14, SHDN_INPUT_PROTECTION15, SHDN_INPUT_PROTECTION16, SHDN_INPUT_PROTECTION17, SHDN_INPUT_PROTECTION18. Parts and nets are listed once, with the designators drawn on the sheet.
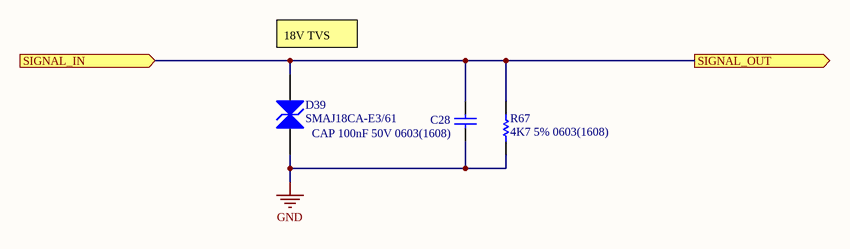
[diagram p3: 12VInputProtection.SchDoc]

### Parts
C28  CAP 100nF 50V 0603(1608)  [CAPC0603(1608)100_L]
D39  SMAJ18CA-E3/61  [VISH-DO-214AC-2_M]
R67  4K7 5% 0603(1608)  [RESC0603(1608)_N]

### Ports
SIGNAL_IN (in), SIGNAL_OUT (out)

### Nets
GND: C28.2 D39.1(A1) R67.1
SIGNAL_IN: C28.1 D39.2(A2) R67.2 ; port SIGNAL_OUT, port SIGNAL_IN

### Channels
SHDN_INPUT_PROTECTION1: designators end in _SHDN_INPUT_PROTECTION1; ports SIGNAL_IN=SIGNAL_IN1 SIGNAL_OUT=SIGNAL_IN1
SHDN_INPUT_PROTECTION2: designators end in _SHDN_INPUT_PROTECTION2; ports SIGNAL_IN=SIGNAL_IN2 SIGNAL_OUT=SIGNAL_IN2
SHDN_INPUT_PROTECTION3: designators end in _SHDN_INPUT_PROTECTION3; ports SIGNAL_IN=SIGNAL_IN3 SIGNAL_OUT=SIGNAL_IN3
SHDN_INPUT_PROTECTION4: designators end in _SHDN_INPUT_PROTECTION4; ports SIGNAL_IN=SIGNAL_IN4 SIGNAL_OUT=SIGNAL_IN4
SHDN_INPUT_PROTECTION5: designators end in _SHDN_INPUT_PROTECTION5; ports SIGNAL_IN=SIGNAL_IN5 SIGNAL_OUT=SIGNAL_IN5
SHDN_INPUT_PROTECTION6: designators end in _SHDN_INPUT_PROTECTION6; ports SIGNAL_IN=SIGNAL_IN6 SIGNAL_OUT=SIGNAL_IN6
SHDN_INPUT_PROTECTION7: designators end in _SHDN_INPUT_PROTECTION7; ports SIGNAL_IN=SIGNAL_IN7 SIGNAL_OUT=SIGNAL_IN7
SHDN_INPUT_PROTECTION8: designators end in _SHDN_INPUT_PROTECTION8; ports SIGNAL_IN=SIGNAL_IN8 SIGNAL_OUT=SIGNAL_IN8
SHDN_INPUT_PROTECTION9: designators end in _SHDN_INPUT_PROTECTION9; ports SIGNAL_IN=SIGNAL_IN9 SIGNAL_OUT=SIGNAL_IN9
SHDN_INPUT_PROTECTION10: designators end in _SHDN_INPUT_PROTECTION10; ports SIGNAL_IN=SIGNAL_IN10 SIGNAL_OUT=SIGNAL_IN10
SHDN_INPUT_PROTECTION11: designators end in _SHDN_INPUT_PROTECTION11; ports SIGNAL_IN=SIGNAL_IN11 SIGNAL_OUT=SIGNAL_IN11
SHDN_INPUT_PROTECTION12: designators end in _SHDN_INPUT_PROTECTION12; ports SIGNAL_IN=SIGNAL_IN12 SIGNAL_OUT=SIGNAL_IN12
SHDN_INPUT_PROTECTION13: designators end in _SHDN_INPUT_PROTECTION13; ports SIGNAL_IN=SIGNAL_IN13 SIGNAL_OUT=SIGNAL_IN13
SHDN_INPUT_PROTECTION14: designators end in _SHDN_INPUT_PROTECTION14; ports SIGNAL_IN=SIGNAL_IN14 SIGNAL_OUT=SIGNAL_IN14
SHDN_INPUT_PROTECTION15: designators end in _SHDN_INPUT_PROTECTION15; ports SIGNAL_IN=SIGNAL_IN15 SIGNAL_OUT=SIGNAL_IN15
SHDN_INPUT_PROTECTION16: designators end in _SHDN_INPUT_PROTECTION16; ports SIGNAL_IN=SIGNAL_IN16 SIGNAL_OUT=SIGNAL_IN16
SHDN_INPUT_PROTECTION17: designators end in _SHDN_INPUT_PROTECTION17; ports SIGNAL_IN=SIGNAL_IN17 SIGNAL_OUT=SIGNAL_IN17
SHDN_INPUT_PROTECTION18: designators end in _SHDN_INPUT_PROTECTION18; ports SIGNAL_IN=SIGNAL_IN18 SIGNAL_OUT=SIGNAL_IN18

### Notes on the sheet
- 18V TVS
- Title
- Size:
- Date:
- A4
- Number:
- Time:
- Revision:
- Sheet
- of
- File:

### Library data of the parts
C28 = CMP-1035-02591-1: as C1 on sheet BSPD_Simulation; Rated Voltage: 50 V; Max Thickness: 1 mm; Technology: SMT; Value: 100nF
D39 = CMP-0548-00180-2: Transient Voltage Suppressor, 6.40 to 231 V, 18 V Stand-off Voltage, Bi-Directional, -55 to 155 degC, 2-pin DO-214AC, Pb-Free, Tape and Reel; Manufacturer: Vishay Semiconductor; VWM (V): 18; IFSM: 40 A; VBR Bi-Directional (V): 6.4 to 231; ID (uA): 2; PPPM (W): 400, 300; PackageDescription: 2-Pin DO-214AC (SMA), Body 4.245 x 2.665 mm; ComponentLink1Description: Manufacturer URL; RoHS: TRUE; ComponentLink3Description: Package Specification; ComponentLink3URL: http://www.vishay.com/docs/88390/smaj50a.pdf; Mounting Technology: Surface Mount; DatasheetVersion: 12/8/2013; ComponentLink1URL: http://www.vishay.com/; ComponentLink2URL: http://www.vishay.com/docs/88390/smaj50a.pdf; PackageReference: DO-214AC-2; ComponentLink2Description: Datasheet; PartNumber: SMAJ18CA-E3/61; Packing: Tape and Reel; Operating Junction and Storage Temperature Range: -55 to 150 degC
R67 = CMP-1012-00090-1: as R1 on sheet BSPD_Simulation; Tolerance: 5 %; Technology: SMT; Power: 0.1 W

## Nets that join several sheets
+5: ShutdownSegement (R65.1), BSPD_Simulation (10 pins)
GND: ShutdownSegement (D38.1 DS11.2 J1.12 Q2.2), BSPD_Simulation (21 pins), SHDN_INPUT_PROTECTION1 (C28_SHDN_INPUT_PROTECTION1.2 D39_SHDN_INPUT_PROTECTION1.1 R67_SHDN_INPUT_PROTECTION1.1), SHDN_INPUT_PROTECTION2 (C28_SHDN_INPUT_PROTECTION2.2 D39_SHDN_INPUT_PROTECTION2.1 R67_SHDN_INPUT_PROTECTION2.1), SHDN_INPUT_PROTECTION3 (C28_SHDN_INPUT_PROTECTION3.2 D39_SHDN_INPUT_PROTECTION3.1 R67_SHDN_INPUT_PROTECTION3.1), SHDN_INPUT_PROTECTION4 (C28_SHDN_INPUT_PROTECTION4.2 D39_SHDN_INPUT_PROTECTION4.1 R67_SHDN_INPUT_PROTECTION4.1), SHDN_INPUT_PROTECTION5 (C28_SHDN_INPUT_PROTECTION5.2 D39_SHDN_INPUT_PROTECTION5.1 R67_SHDN_INPUT_PROTECTION5.1), SHDN_INPUT_PROTECTION6 (C28_SHDN_INPUT_PROTECTION6.2 D39_SHDN_INPUT_PROTECTION6.1 R67_SHDN_INPUT_PROTECTION6.1), SHDN_INPUT_PROTECTION7 (C28_SHDN_INPUT_PROTECTION7.2 D39_SHDN_INPUT_PROTECTION7.1 R67_SHDN_INPUT_PROTECTION7.1), SHDN_INPUT_PROTECTION8 (C28_SHDN_INPUT_PROTECTION8.2 D39_SHDN_INPUT_PROTECTION8.1 R67_SHDN_INPUT_PROTECTION8.1), SHDN_INPUT_PROTECTION9 (C28_SHDN_INPUT_PROTECTION9.2 D39_SHDN_INPUT_PROTECTION9.1 R67_SHDN_INPUT_PROTECTION9.1), SHDN_INPUT_PROTECTION10 (C28_SHDN_INPUT_PROTECTION10.2 D39_SHDN_INPUT_PROTECTION10.1 R67_SHDN_INPUT_PROTECTION10.1), SHDN_INPUT_PROTECTION11 (C28_SHDN_INPUT_PROTECTION11.2 D39_SHDN_INPUT_PROTECTION11.1 R67_SHDN_INPUT_PROTECTION11.1), SHDN_INPUT_PROTECTION12 (C28_SHDN_INPUT_PROTECTION12.2 D39_SHDN_INPUT_PROTECTION12.1 R67_SHDN_INPUT_PROTECTION12.1), SHDN_INPUT_PROTECTION13 (C28_SHDN_INPUT_PROTECTION13.2 D39_SHDN_INPUT_PROTECTION13.1 R67_SHDN_INPUT_PROTECTION13.1), SHDN_INPUT_PROTECTION14 (C28_SHDN_INPUT_PROTECTION14.2 D39_SHDN_INPUT_PROTECTION14.1 R67_SHDN_INPUT_PROTECTION14.1), SHDN_INPUT_PROTECTION15 (C28_SHDN_INPUT_PROTECTION15.2 D39_SHDN_INPUT_PROTECTION15.1 R67_SHDN_INPUT_PROTECTION15.1), SHDN_INPUT_PROTECTION16 (C28_SHDN_INPUT_PROTECTION16.2 D39_SHDN_INPUT_PROTECTION16.1 R67_SHDN_INPUT_PROTECTION16.1), SHDN_INPUT_PROTECTION17 (C28_SHDN_INPUT_PROTECTION17.2 D39_SHDN_INPUT_PROTECTION17.1 R67_SHDN_INPUT_PROTECTION17.1), SHDN_INPUT_PROTECTION18 (C28_SHDN_INPUT_PROTECTION18.2 D39_SHDN_INPUT_PROTECTION18.1 R67_SHDN_INPUT_PROTECTION18.1)